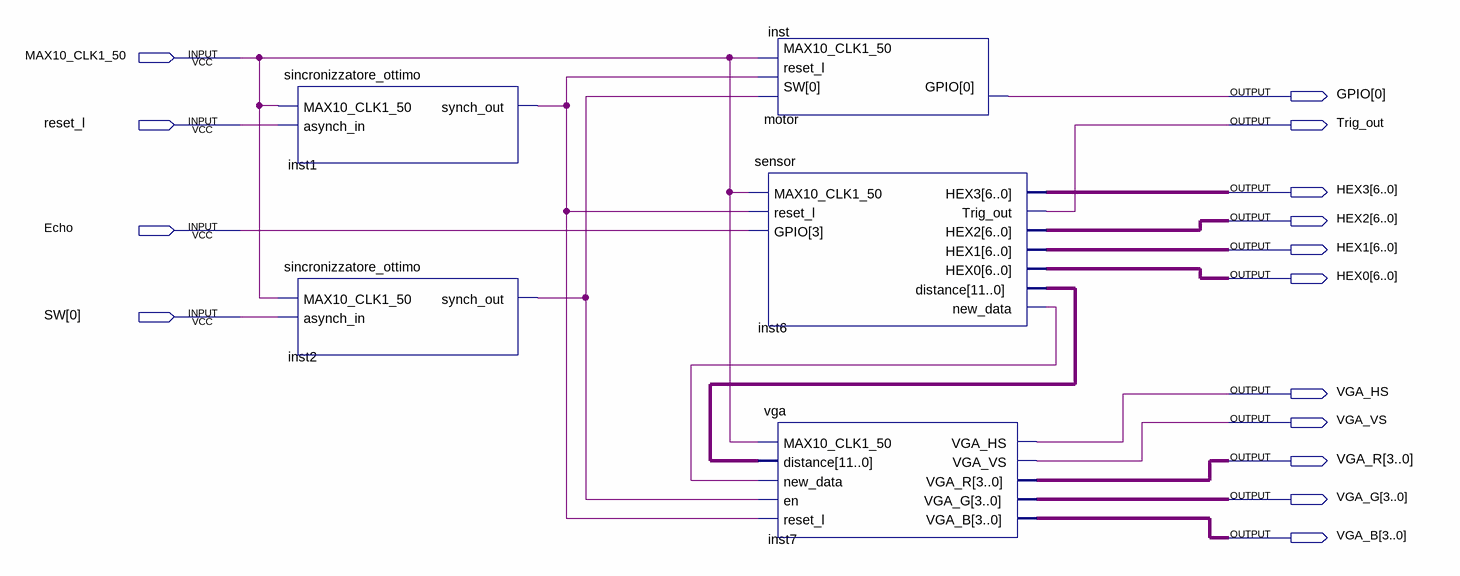
[diagram p0: schematic sheet]
// Quartus schematic radar.bdf as structural Verilog: 5 symbols, 15 pins
module radar (
  input  MAX10_CLK1_50,
  input  reset_l,
  input  Echo,
  input  [0:0] SW,
  output [0:0] GPIO,
  output Trig_out,
  output [6:0] HEX3,
  output [6:0] HEX2,
  output [6:0] HEX1,
  output [6:0] HEX0,
  output VGA_HS,
  output VGA_VS,
  output [3:0] VGA_R,
  output [3:0] VGA_G,
  output [3:0] VGA_B
);

  wire inst1_synch_out, inst2_synch_out, inst6_new_data;
  wire [11:0] inst6_distance;

  sincronizzatore_ottimo inst1 (.MAX10_CLK1_50(MAX10_CLK1_50), .asynch_in(reset_l), .synch_out(inst1_synch_out));
  sincronizzatore_ottimo inst2 (.MAX10_CLK1_50(MAX10_CLK1_50), .asynch_in(SW[0]), .synch_out(inst2_synch_out));
  motor inst (.SW(inst2_synch_out), .reset_l(inst1_synch_out), .MAX10_CLK1_50(MAX10_CLK1_50), .GPIO(GPIO[0]));
  sensor inst6 (
    .MAX10_CLK1_50(MAX10_CLK1_50), .reset_l(inst1_synch_out), .GPIO(Echo), .HEX3(HEX3), .Trig_out(Trig_out),
    .HEX2(HEX2), .HEX1(HEX1), .HEX0(HEX0), .distance(inst6_distance), .new_data(inst6_new_data));
  vga inst7 (
    .MAX10_CLK1_50(MAX10_CLK1_50), .distance(inst6_distance), .new_data(inst6_new_data),
    .en(inst2_synch_out), .reset_l(inst1_synch_out), .VGA_HS(VGA_HS), .VGA_VS(VGA_VS), .VGA_R(VGA_R),
    .VGA_G(VGA_G), .VGA_B(VGA_B));
endmodule
